# Altium schematic sheet AUDIO_AMP_MAX9812L.SchDoc: AUDIO AC99 Interface
size A4; Organization: Altium Limited.; Address1: Level 3, 12a Rodborough Rd; Address2: Frenchs Forest 2086; Address3: NSW; Address4: AUSTRALIA; Revision: 6; SheetNumber: 54; SheetTotal: 64
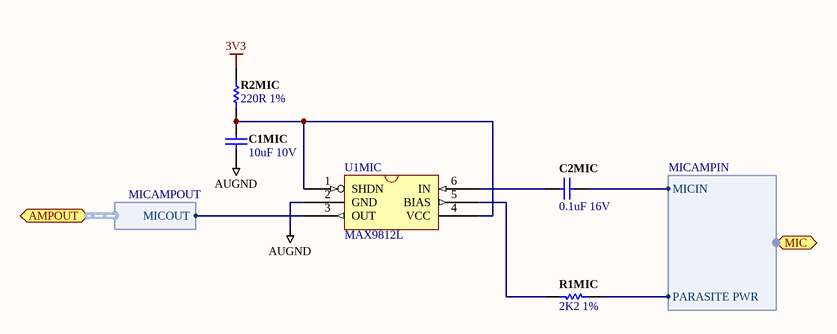
[diagram p0: AUDIO_AMP_MAX9812L.SchDoc]

## Parts
C1MIC  10uF 10V  [CAPC2012-STAR]
C2MIC  0.1uF 16V  [CAPC1005-STAR]
R1MIC  2K2 1%  [RESC1005-STAR]
R2MIC  220R 1%  [RESC1005-STAR]
U1MIC  MAX9812L  [SC70_6L]

## Ports
AMPOUT (harness MICAMPOUT), MIC (harness MICAMPIN)

## Harnesses
MICAMPIN: MICIN, PARASITE PWR
MICAMPOUT: MICOUT

## Nets
3V3: R2MIC.2
AUGND: C1MIC.1 U1MIC.2(GND)
NetC1MIC_2: C1MIC.2 R2MIC.1 U1MIC.1(SHDN) U1MIC.4(VCC)
NetC2MIC_1: C2MIC.1 ; port MIC.MICIN
NetC2MIC_2: C2MIC.2 U1MIC.6(IN)
NetR1MIC_1: R1MIC.1 U1MIC.5(BIAS)
NetR1MIC_2: R1MIC.2 ; port MIC.PARASITE PWR
NetU1MIC_3: U1MIC.3(OUT) ; port AMPOUT.MICOUT

## Notes on the sheet
- Sheet Title
- Project Title
- Size:
- Date:
- A4
- Assy:
- Time:
- Sheet
- Revision:
- of
- File:

## Library data of the parts
C1MIC = D-101-0087: Capacitor, Ceramic, 10uF 10% 10V 0805 (2012) X5R; Polarity: Non-Polarized; Category: Capacitor; Capacitance: 10 uF; Dielectric: X5R; Mounting Technology: Surface Mount; Rated Voltage: 10 V; Status: Unreleased; Technology: None; Tolerance: 10 %
C2MIC = D-101-0080: Capacitor, Ceramic, 0.1uF 10% 16V 0402 (1005) X7R; Polarity: Non-Polarized; Category: Capacitor; Capacitance: 0.1 uF; Dielectric: X7R; Mounting Technology: Surface Mount; Rated Voltage: 16 V; Status: Production; Technology: Ceramic; Tolerance: 10 %
R1MIC = D-100-0107: Resistor, 2K2 1% 0402 (1005); Power Rating: 63 mW; Resistance: 2.2 K; Category: Resistor; Mounting Technology: Surface Mount; Status: Production; Tolerance: 1 %
R2MIC = D-100-0115: Resistor, 220R 1% 0402 (1005); Power Rating: 63 mW; Category: Resistor; Status: Production; Mounting Technology: Surface Mount; Resistance: 220 R; Tolerance: 1 %
U1MIC = D-201-0004: MAX9812L, Microphone Pre-Amplifier, single, 20dB gain, Shutdown; Supply Voltage: 2.7-3.6 mV; AudioICTypes: Amplifier; Mounting Technology: Surface Mount; Status: Production; Temperature Range: -40 to +85; Category: IC-Audio